# EasyEDA schematic PROTO1b_SCH.json
TITLE: KurupiSat; REV: 1.0; Date: 2019-07-03; Sheet: 1/1; Drawn By: KusupiSat Team; Company: KusupiSat Team
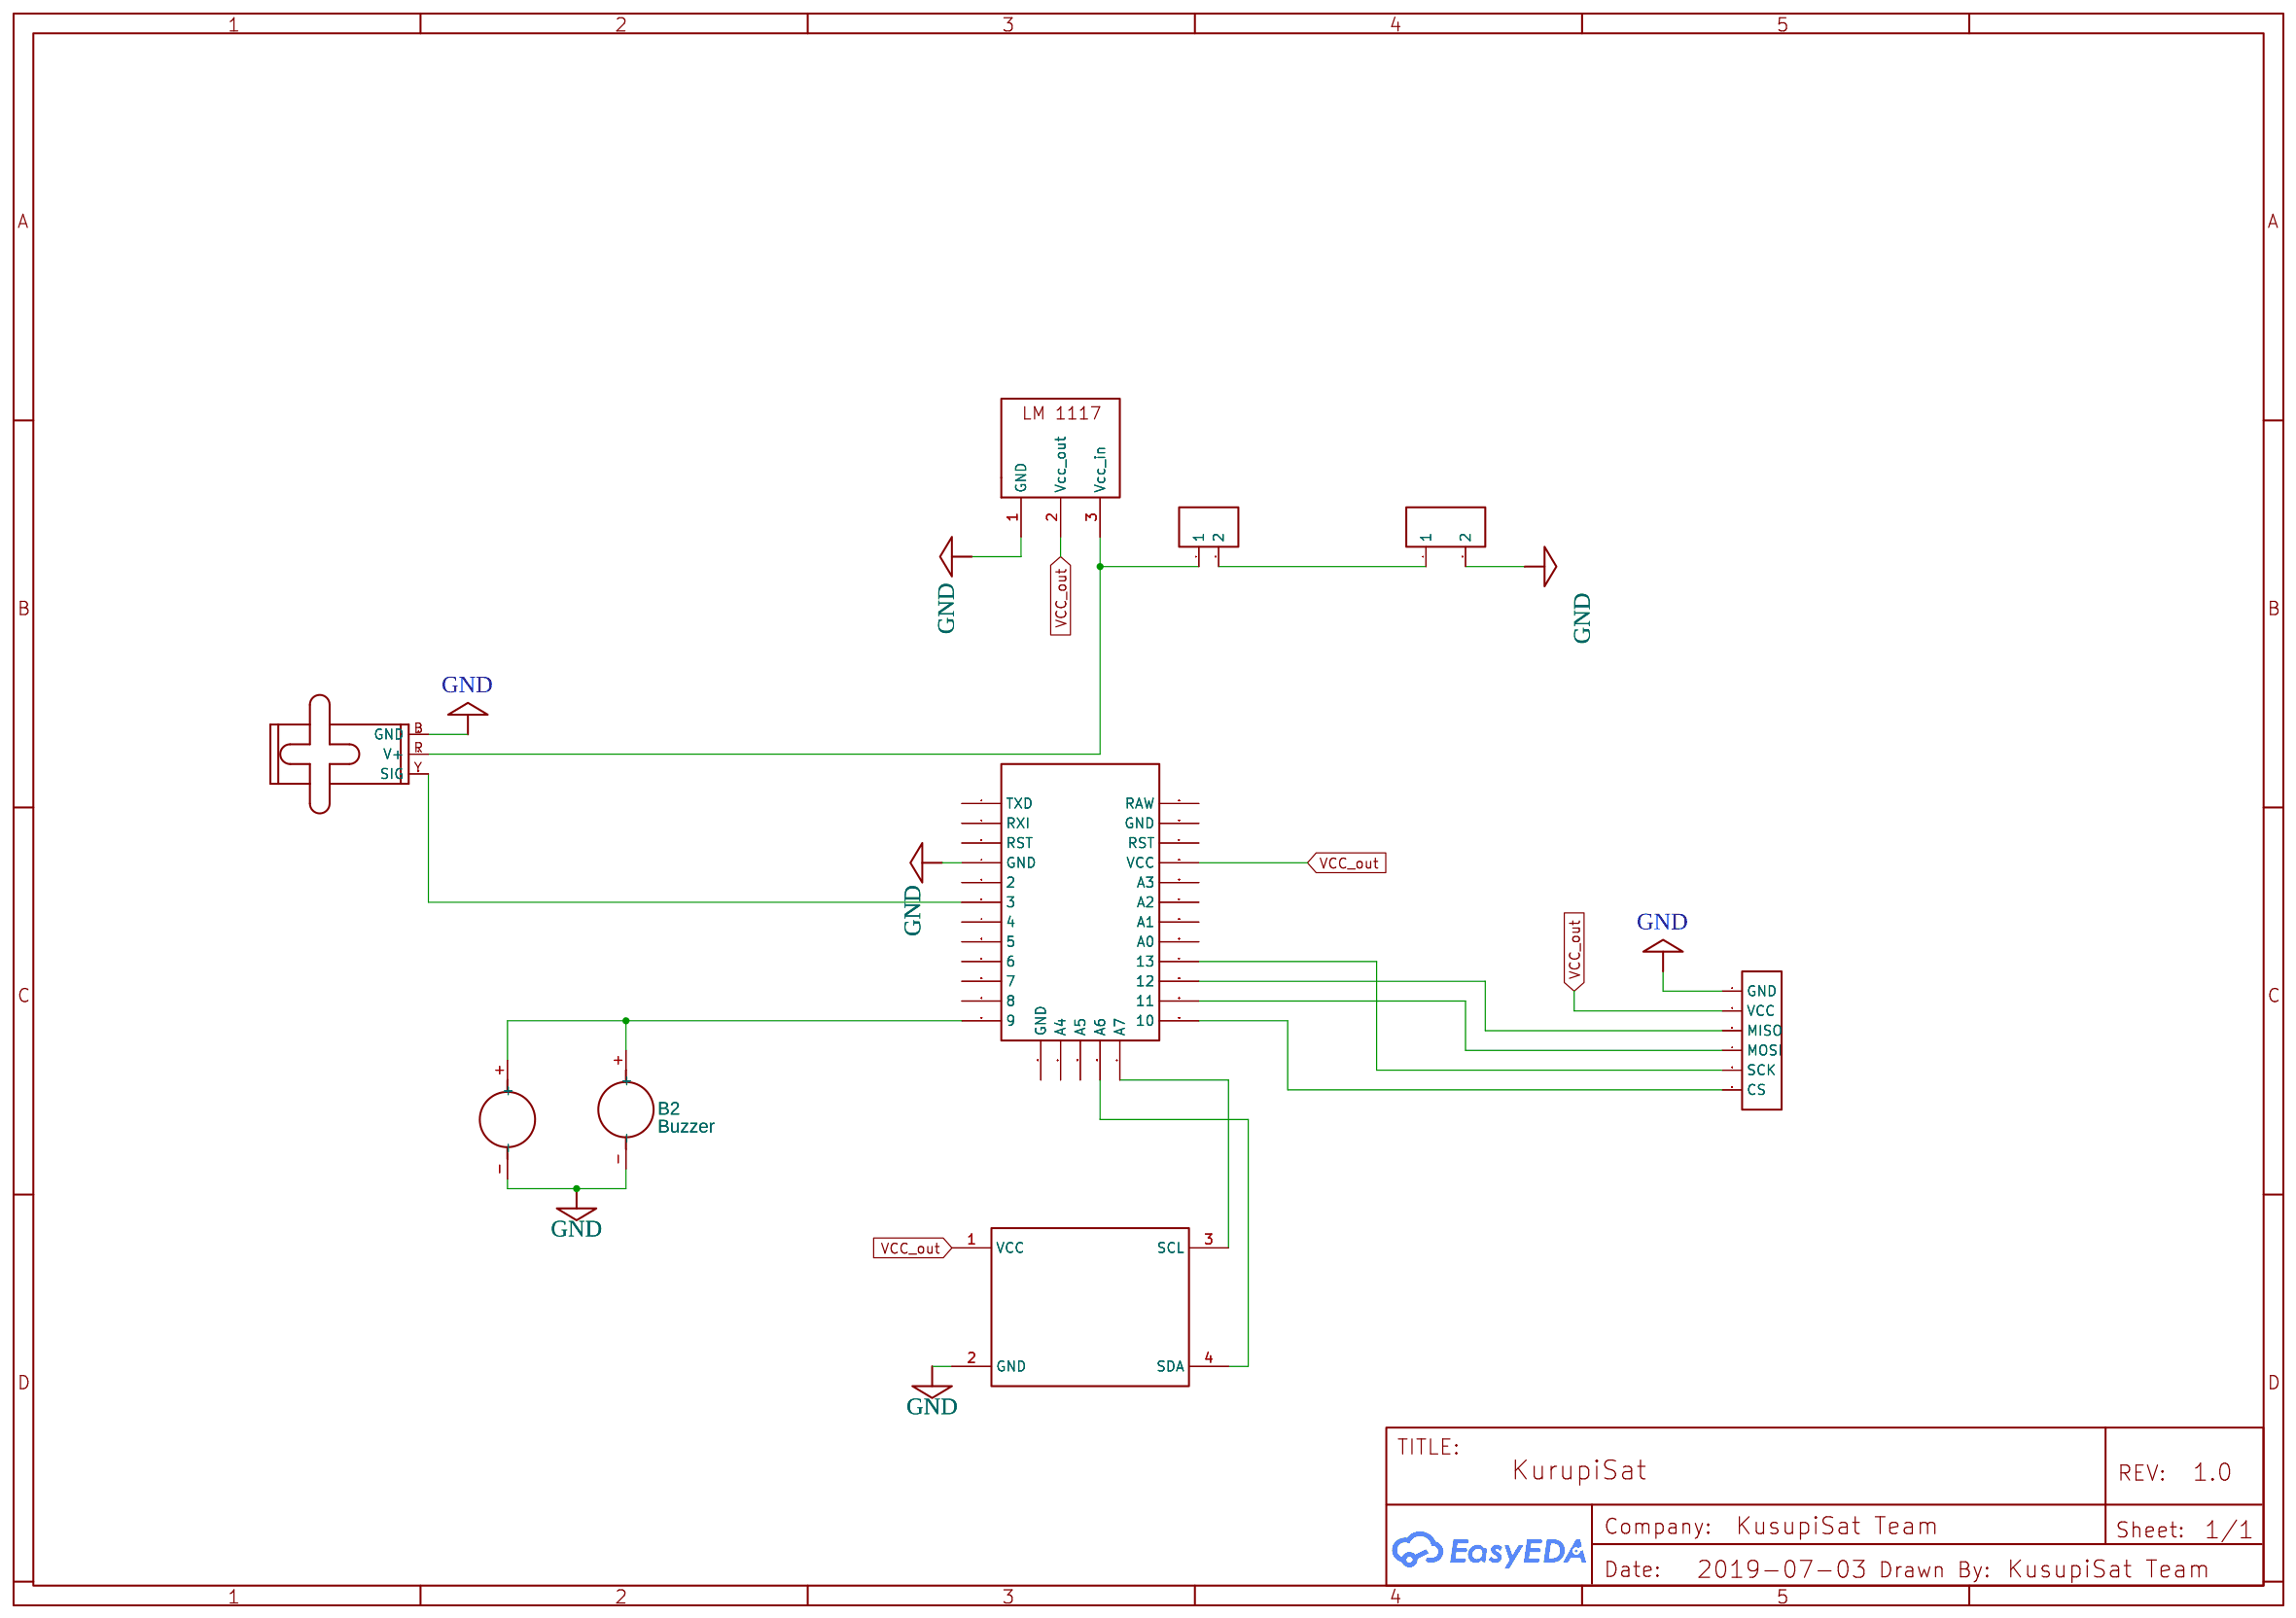
[diagram p0: schematic sheet]

## Parts
ARDUINO2  ARDUINO PRO MINI  [ARDUINO PRO MINI]
B1  Buzzer  [BZ2-7.6-D12.0XH6.5MM]
B2  Buzzer  [BZ2-7.6-D12.0XH6.5MM]
BATERIA2  Header-Male-2.54_1x2  [HDR-2X1/2.54]
BMP  BMP180  [PKG-GY68(BMP180)]
MEMORY2  MicroSd Card Reader  [HDR-6X1/2.54]
REG2  LM AMS1117  [LM 1117 OBUD]
SERVO2  servo2  [1X03]
SWITCH2  Header-Female-2.54_1x2  [HDR-1X2/2.54]

## Library data of the parts
ARDUINO2 = -: Contributor: azend
B1 B2 = -: DIP Buzzer 3V-30mA- 2700; Manufacturer Part: KS-12065D03YA
BATERIA2 = -: Supplier: LCSC; Manufacturer: TE Connectivity; Manufacturer Part: 826629-2; image: //image.lceda.cn/szlcsc/C86471.jpg; Supplier Part: C86471
BMP = -: Supplier: Futura Elettronica; Manufacturer: Unknow; Manufacturer Part: Unknow; Supplier Part: 2846-BMP180; link: http://dlnmh9ip6v2uc.cloudfront.net/datasheets/Sensors/Pressure/BMP180.pdf; Contributor: Prof. Ing. F. Scordino
MEMORY2 = -: Supplier: LCSC; Manufacturer: BOOMELE; Manufacturer Part: Female header 1*6p; Supplier Part: C40877
REG2 = -: Manufacturer Part: New SchematicLib; Contributor: robert7519
SERVO2 = -: Manufacturer Part: ?
SWITCH2 = -: Supplier: LCSC; Manufacturer: BOOMELE; Manufacturer Part: 2.54-1*2PFemale; image: //image.lceda.cn/szlcsc/C49661.jpg; Supplier Part: C49661

## Nets
GND: ARDUINO2.4(GND) B1.- B2.- BATERIA2.2 BMP.2(GND) MEMORY2.1(GND) REG2.1(GND) SERVO2.1(GND)
VCC_out: ARDUINO2.26(VCC) BMP.1(VCC) MEMORY2.2(VCC) REG2.2(Vcc out)
Net-(ARDUINO2-6): ARDUINO2.6(3) SERVO2.3(SIG)
Net-(ARDUINO2-12): ARDUINO2.12(9) B1.+ B2.+
Net-(ARDUINO2-16): ARDUINO2.16(A6) BMP.4(SDA)
Net-(ARDUINO2-17): ARDUINO2.17(A7) BMP.3(SCL)
Net-(ARDUINO2-18): ARDUINO2.18(10) MEMORY2.6(CS)
Net-(ARDUINO2-19): ARDUINO2.19(11) MEMORY2.4(MOSI)
Net-(ARDUINO2-20): ARDUINO2.20(12) MEMORY2.3(MISO)
Net-(ARDUINO2-21): ARDUINO2.21(13) MEMORY2.5(SCK)
Net-(BATERIA2-1): BATERIA2.1 SWITCH2.2
Net-(REG2-3): REG2.3(Vcc in) SERVO2.2(V+) SWITCH2.1

Not connected (* = marked no-connect by the designer): ARDUINO2 1(TXD) 2(RXI) 3(RST) 5(2) 7(4) 8(5) 9(6) 10(7) 11(8) 13(GND) 14(A4) 15(A5) 22(A0) 23(A1) 24(A2) 25(A3) 27(RST) 28(GND) 29(RAW)
